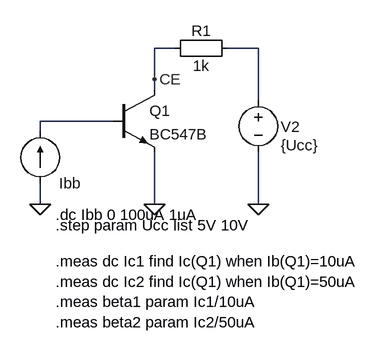
[diagram p0: schematic BJT-TRAN-REGIONS.asc]
BJT-TRAN-REGIONS.asc, the LTspice schematic file:
Version 4
SHEET 1 880 680
WIRE 240 16 208 16
WIRE 368 16 320 16
WIRE 208 64 208 16
WIRE 208 80 208 64
WIRE 368 96 368 16
WIRE 144 128 32 128
WIRE 32 144 32 128
WIRE 32 256 32 224
WIRE 208 256 208 176
WIRE 368 256 368 176
FLAG 208 256 0
FLAG 32 256 0
FLAG 368 256 0
FLAG 208 64 CE
SYMBOL voltage 368 80 R0
WINDOW 3 35 85 Left 2
WINDOW 123 0 0 Left 2
WINDOW 39 0 0 Left 2
WINDOW 0 35 57 Left 2
SYMATTR Value {Ucc}
SYMATTR InstName V2
SYMBOL npn 144 80 R0
SYMATTR InstName Q1
SYMATTR Value BC547B
SYMBOL current 32 224 R180
WINDOW 0 -63 0 Left 2
WINDOW 3 -66 28 Invisible 2
WINDOW 123 0 0 Left 2
WINDOW 39 0 0 Left 2
SYMATTR InstName Ibb
SYMATTR Value 0
SYMBOL Misc\\EuropeanResistor 336 0 R90
WINDOW 0 5 56 VBottom 2
WINDOW 3 27 56 VTop 2
SYMATTR InstName R1
SYMATTR Value 1k
TEXT 56 272 Left 2 !.dc Ibb 0 100uA 1uA
TEXT 56 288 Left 2 !.step param Ucc list 5V 10V
TEXT 56 344 Left 2 !.meas dc Ic1 find Ic(Q1) when Ib(Q1)=10uA\n.meas dc Ic2 find Ic(Q1) when Ib(Q1)=50uA\n.meas beta1 param Ic1/10uA\n.meas beta2 param Ic2/50uA

The netlist it stands for:
* BJT-TRAN-REGIONS.asc
V2 N001 0 {Ucc}
Q1 CE N002 0 0 BC547B
Ibb 0 N002 0
R1 N001 CE 1k
.model NPN NPN
.model PNP PNP
.lib standard.bjt
.dc Ibb 0 100uA 1uA
.step param Ucc list 5V 10V
.meas dc Ic1 find Ic(Q1) when Ib(Q1)=10uA
.meas dc Ic2 find Ic(Q1) when Ib(Q1)=50uA
.meas beta1 param Ic1/10uA
.meas beta2 param Ic2/50uA
.backanno
.end